# EAGLE design probe (EAGLE 9.5.2)
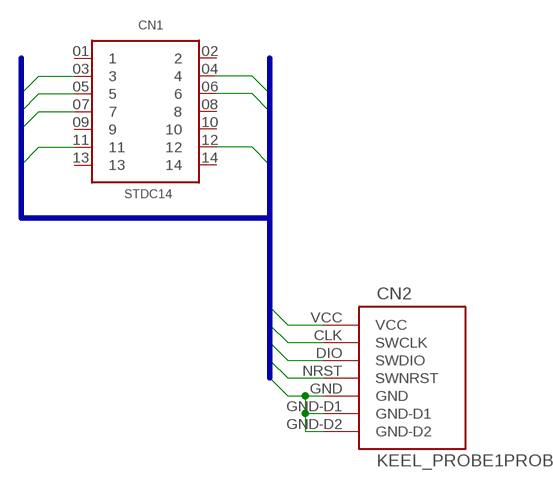
[diagram p0: schematic, sheet 1]

## Parts
CN1  STDC14  FTSH-107  [FTSH-107-01-L-DV-K-A]
CN2  KEEL_PROBE1PROBE  [KEEL_PROBE1]

## Nets
GND: CN1.05 CN1.07 CN1.11 CN2.GND CN2.GND-D1 CN2.GND-D2
NRST: CN1.12 CN2.NRST(SWNRST)
SWCLK: CN1.06 CN2.CLK(SWCLK)
SWDIO: CN1.04 CN2.DIO(SWDIO)
T_VCC: CN1.03 CN2.VCC
Unconnected: CN1.01 CN1.02 CN1.08 CN1.09 CN1.10 CN1.13 CN1.14

## Buses
SWD:GND,NRST,SWCLK,SWDIO,T_VCC

## Library data of the parts
CN1 = con-samtec-FTSH:FTSH-107
CN2 = probe:KEEL_PROBE1: In-circuit probe for the Keel module

## Board
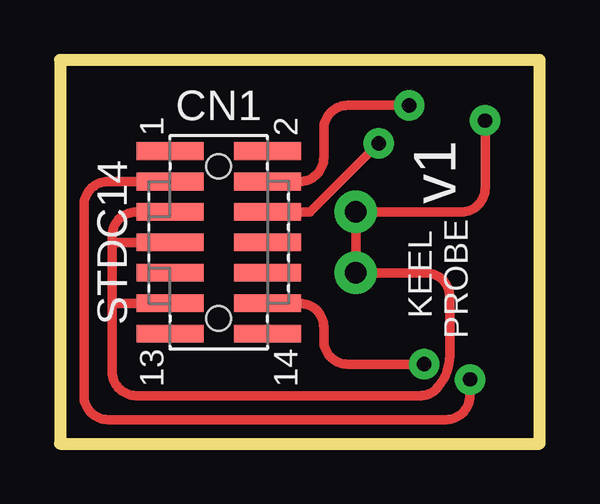
[diagram p1: board, top side]

Size 20 x 16 mm. Coordinates in mm from the lower left corner, seen from the top.
Outline: 0,0 20,0 20,16 0,16 0,0
Copper layers (1*16): Top 0.018mm / dielectric 1.55mm / Bottom 0.018mm
Design rules "eurocircuits *": minimum track width 0.15mm, minimum drill 0.25mm, track to track 0.15mm, track to pad 0.15mm, pad to pad 0.15mm, via to via 0.15mm, smd to smd 0.15mm, copper to edge 0.15mm, drill to drill 40mil, minimum pad ring 0.125mm, minimum via ring 0.125mm, stop-mask expansion 0.03mm, vias tented up to drill 0.25mm, thermal gap 10mil

### Footprints (pad centres in the part's own frame; a part is rotated, then mirrored left to right if it is on the bottom)
FTSH-107-01-L-DV-K-A = smd 0.737 x 2.794: 01 -3.81,-2.032; 02 -3.81,2.032; 03 -2.54,-2.032; 04 -2.54,2.032; 05 -1.27,-2.032; 06 -1.27,2.032; 07 0,-2.032; 08 0,2.032; 09 1.27,-2.032; 10 1.27,2.032; 11 2.54,-2.032; 12 2.54,2.032; 13 3.81,-2.032; 14 3.81,2.032 | hole 1.016: -3.175,0; 3.175,0
KEEL_PROBE1 = drill 0.6 pad 1.27: CLK 4.128,4.128; DIO 5.715,2.857; GND 5.08,-0.318; NRST -5.08,2.223; VCC -5.715,0.318 | drill 0.9 pad 1.778: GND-D1 -1.27,5.08; GND-D2 1.27,5.08

### Placement (x,y rotation side)
CN1  6.62,8.39 270 top
CN2  17.41,8.39 90 top

### Tracks (layer width: path | path; a pad name or v marks a point on that pad's centre or on a via)
GND
  Top 0.4: CN2.GND-D1 CN2.GND-D2 16.73,9.66 arc90 17.73,10.66 CN2.GND | CN2.GND-D1 12.97,7.12 | 2.17,5.85 2.17,8.39 | CN1.07 2.17,8.39 | CN1.11 2.17,5.85 | CN1.05 3.17,9.66 arc90 2.17,8.66 2.17,8.39 | 2.17,5.85 2.17,3 arc90 3.17,2 15.04,2 arc45 15.67,2.26 arc45 16.25,3.66 16.25,6.12 arc90 15.25,7.12 CN2.GND-D1
NRST
  Top 0.4: CN2.NRST 12,3.31 arc-90 11,4.31 11,4.85 arc90 10,5.85 CN1.12
SWCLK
  Top 0.4: CN1.06 10.43,9.66 CN2.CLK
SWDIO
  Top 0.4: CN1.04 10,10.93 arc90 11,11.93 11,13.11 arc-90 12,14.11 CN2.DIO
T_VCC
  Top 0.4: 3.7,10.93 CN1.03 2,10.93 arc90 1,9.93 1,2 arc90 2,1 16.1,1 arc90 17.1,2 CN2.VCC

### Text on the board
tNames: v1 | KEEL / PROBE